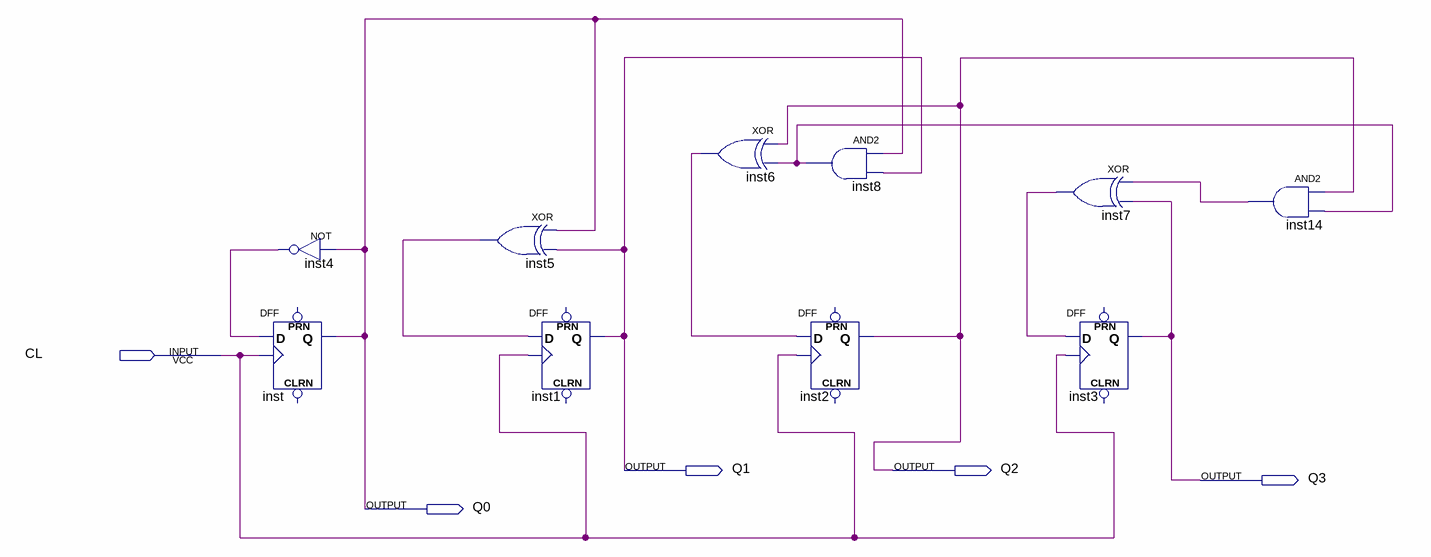
[diagram p0: schematic sheet]
// Quartus schematic sync4.bdf as structural Verilog: 10 symbols, 5 pins
module sync4 (
  input  CL,
  output Q1,
  output Q2,
  output Q3,
  output Q0
);

  wire inst4_out, inst5_out, inst6_out, inst7_out, inst8_out, inst14_out;

  not inst4 (inst4_out, Q0);
  DFF inst (.CLK(CL), .D(inst4_out), .Q(Q0));  // open: CLRN, PRN
  xor inst5 (inst5_out, Q0, Q1);
  DFF inst1 (.CLK(CL), .D(inst5_out), .Q(Q1));  // open: CLRN, PRN
  xor inst6 (inst6_out, Q2, inst8_out);
  and inst8 (inst8_out, Q0, Q1);
  DFF inst2 (.CLK(CL), .D(inst6_out), .Q(Q2));  // open: CLRN, PRN
  xor inst7 (inst7_out, inst14_out, Q3);
  DFF inst3 (.CLK(CL), .D(inst7_out), .Q(Q3));  // open: CLRN, PRN
  and inst14 (inst14_out, Q2, inst8_out);
endmodule
